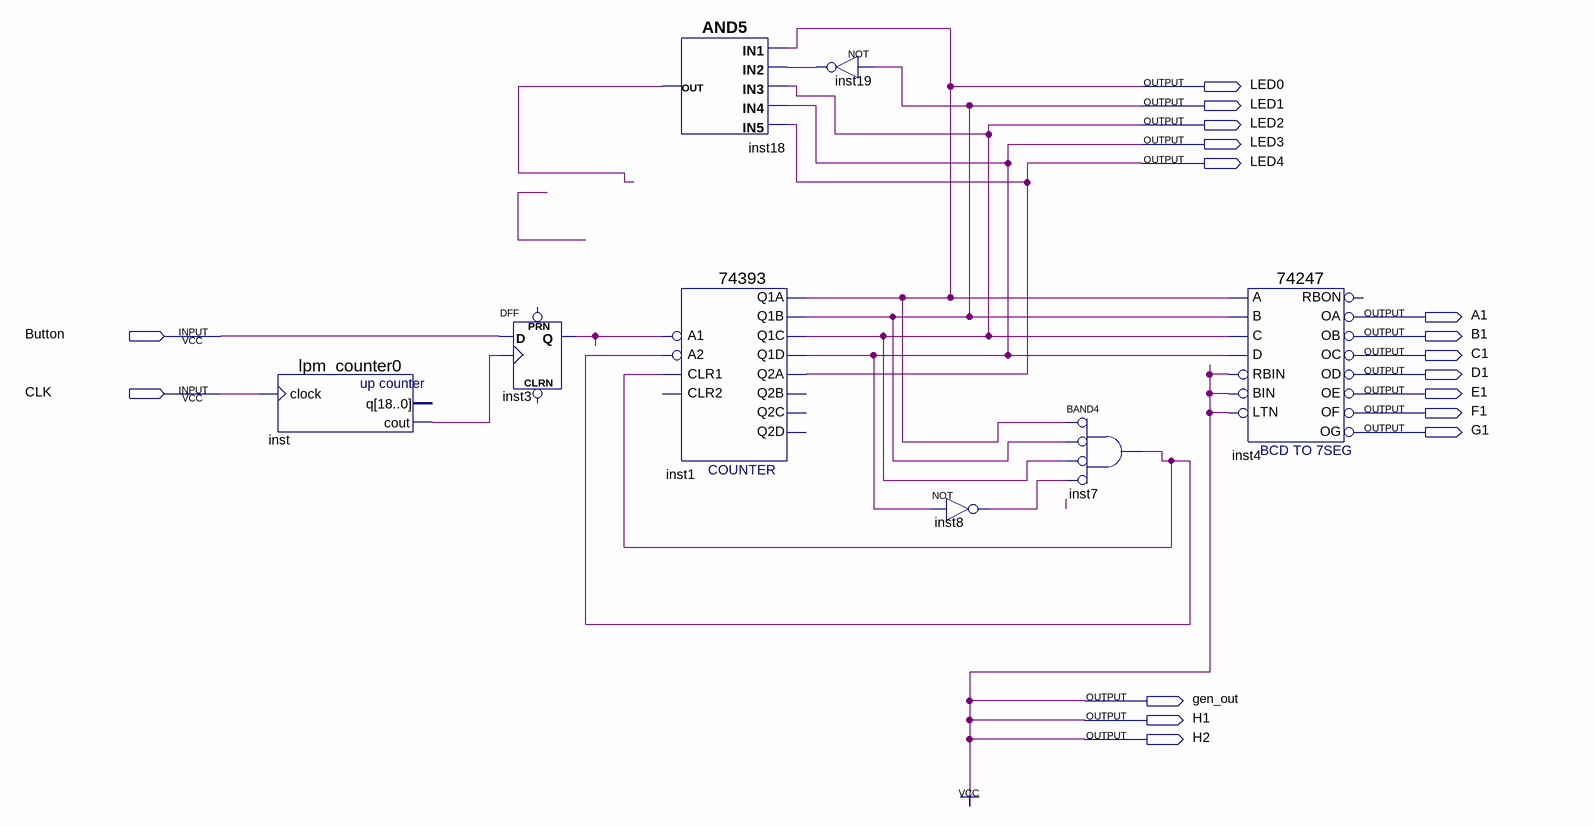
[diagram p0: schematic sheet]
// Quartus schematic 31.bdf as structural Verilog: 8 symbols, 17 pins
module \31  (
  input  Button,
  input  CLK,
  output LED0,
  output LED1,
  output LED2,
  output LED3,
  output LED4,
  output A1,
  output B1,
  output C1,
  output D1,
  output E1,
  output F1,
  output G1,
  output gen_out,
  output H1,
  output H2
);

  wire inst3_q, inst7_out, inst8_out, inst18_out, inst19_out, inst_cout;

  lpm_counter0 inst (.clock(CLK), .cout(inst_cout));  // open: q
  DFF inst3 (.CLK(inst_cout), .D(Button), .Q(inst3_q));  // open: CLRN, PRN
  and inst18 (inst18_out, LED0, inst19_out, LED2, LED3, LED4);
  \74393  inst1 (
    .A1(inst3_q), .CLR1(inst7_out), .A2(inst7_out), .Q1C(LED2), .Q1D(LED3), .Q2A(LED4), .Q1A(LED0), .Q1B(LED1));  // open: CLR2, Q2D, Q2C, Q2B
  not inst19 (inst19_out, LED1);
  not inst8 (inst8_out, LED3);
  and inst7 (inst7_out, ~LED0, ~LED1, ~LED2, ~inst8_out);  // BAND4
  \74247  inst4 (
    .LTN(1'b1), .BIN(1'b1), .A(LED0), .B(LED1), .RBIN(1'b1), .C(LED2), .D(LED3), .OF(F1), .OC(C1), .OD(D1),
    .OE(E1), .OA(A1), .OB(B1), .OG(G1));  // open: RBON

  assign gen_out = 1'b1;
  assign H1 = 1'b1;
  assign H2 = 1'b1;
endmodule
